# EAGLE schematic schematic_vibrotactile_driver (EAGLE 9.3.0)
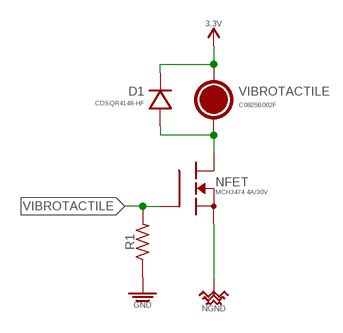
[diagram p0: schematic, sheet 1]

## Parts
D1  CDSQR4148-HF  GENERAL-PURPOSE_SMD-0402_GP_150MA-75V  [DFN100X60X55-2]
NFET  MCH3474 4A/30V  POWER_NCHAN_MCH3474_NMOS_4A-30V  [SOTFL65P209X90-3]
R1  10K  10KΩ_SMD-0402_1/16W-5%  [RESC1005X35_SMD-0402]
VIBROTACTILE  C0825B002F  VIBE-MOTOR_CONNECTOR_0530470210_VERT-MALE_PITCH-1.25MM  [_MOLEX-0530470210_VERT_PITCH-1.25MM]

## Nets
3.3V: D1.K VIBROTACTILE.1(+)
GND [DGND]: R1.1
N$30: D1.A NFET.3(D) VIBROTACTILE.2(-)
NGND [NGND]: NFET.2(S)
VIBROTACTILE: NFET.1(G) R1.2

## Library data of the parts
D1 = _discrete_semiconductors:GENERAL-PURPOSE; DATASHEET: http://www.comchiptech.com/cms/UserFiles/CDSQR4148-HF-RevC213424.pdf; DIST: Digikey; DISTLINK: https://www.digikey.com/products/en?keywords=641-1677-1-ND; DISTPN: 641-1677-1-ND; MFR: Comchip Technology; MPN: CDSQR4148-HF; VALUE: 150mA/75V
NFET = _transistors:POWER_NCHAN: Collection of Power MOSFET; DATASHEET: https://media.digikey.com/pdf/Data%20Sheets/ON%20Semiconductor%20PDFs/MCH3474.pdf; DIST: Digikey; DISTLINK: https://www.digikey.com/products/en?keywords=MCH3474-TL-WOSCT; DISTPN: MCH3474-TL-WOSCT-ND; MFR: ON Semiconductor; MPN: MCH3474-TL-W
R1 = _resistors:10KΩ; DATASHEET: http://www.yageo.com/NewPortal/yageodocoutput?fileName=/pdf/R-Chip/PYu-RC_51_RoHS_P_0.pdf; DIST: Digikey; DISTLINK: https://www.digikey.com/products/en?keywords=YAG1281CT-ND; DISTPN: YAG1281CT-ND; MFR: Yageo; MPN: RC0402JR-0710KP
VIBROTACTILE = _actuators:VIBE-MOTOR_CONNECTOR; DATASHEET: http://www.vibration-motor.com/products/download/C0825B002F.pdf; DATASHEET_CONNECTOR1: https://www.molex.com/pdm_docs/sd/530470210_sd.pdf; DATASHEET_CONNECTOR2: https://www.molex.com/pdm_docs/sd/510210700_sd.pdf; DATASHEET_CRIMP: https://www.molex.com/pdm_docs/sd/500798000_sd.pdf; DIST: Digikey; DISTLINK: https://www.digikey.com/products/en?keywords=1670-1002-ND; DISTLINK_CONNECTOR1: https://www.digikey.com/products/en?keywords=WM1731-ND; DISTLINK_CONNECTOR2: https://www.digikey.com/products/en?keywords=WM1720-ND; DISTLINK_CRIMP: https://www.digikey.com/products/en?keywords=WM1142CT-ND; DISTPN: 1670-1002-ND; DISTPN_CONNECTOR1: WM1731-ND; DISTPN_CONNECTOR2: WM1720-ND; DISTPN_CRIMP: WM1142CT-ND; DIST_CONNECTOR1: Digikey; DIST_CONNECTOR2: Digikey; DIST_CRIMP: Digikey; MFR: Jinlong Machinery & Electronics, Inc.; MFR_CONNECTOR1: Molex, LLC; MFR_CONNECTOR2: Molex, LLC; MFR_CRIMP: Molex, LLC; MPN: C0825B002F; MPN_CONNECTOR1: 0530470210; MPN_CONNECTOR2: 51021-0200; MPN_CRIMP: 0500798000; VALUE: Molex VERT 1.25mm pitch

## Net classes
4 DGND: width 0.254 mm
5 NGND: width 0.254 mm